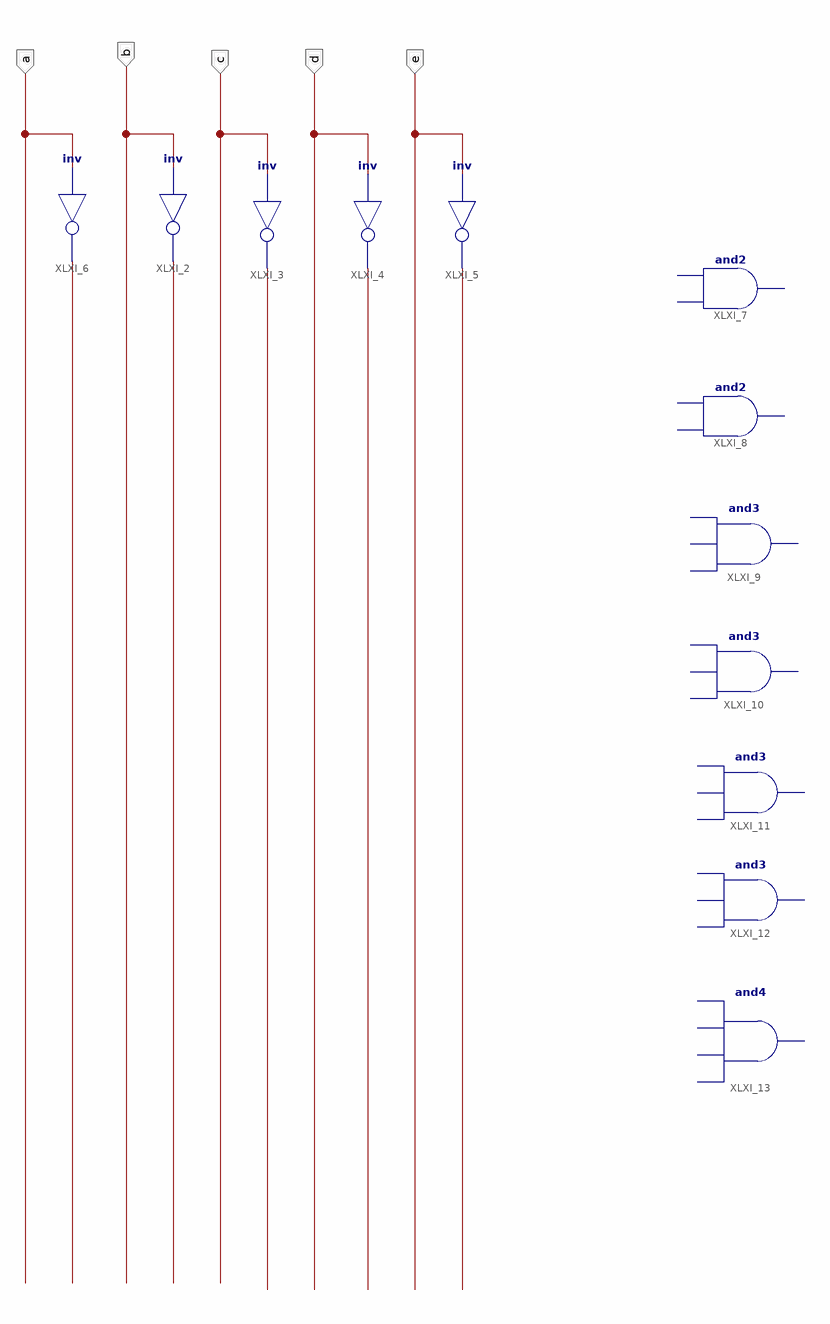
[diagram p0: schematic sheet 1]
// Xilinx ISE schematic main.sch (spartan6) as structural Verilog: 12 symbols, 5 ports
module main (
  input  a,
  input  b,
  input  c,
  input  d,
  input  e
);

  wire XLXN_1, XLXN_3, XLXN_7, XLXN_9, XLXN_10;

  not XLXI_2 (XLXN_3, b);
  not XLXI_3 (XLXN_9, c);
  not XLXI_4 (XLXN_7, d);
  not XLXI_5 (XLXN_10, e);
  not XLXI_6 (XLXN_1, a);
  // and2 XLXI_7 is placed but not wired
  // and2 XLXI_8 is placed but not wired
  // and3 XLXI_9 is placed but not wired
  // and3 XLXI_10 is placed but not wired
  // and3 XLXI_11 is placed but not wired
  // and3 XLXI_12 is placed but not wired
  // and4 XLXI_13 is placed but not wired
endmodule
